# Altium project camera_module_dev.PrjPcb
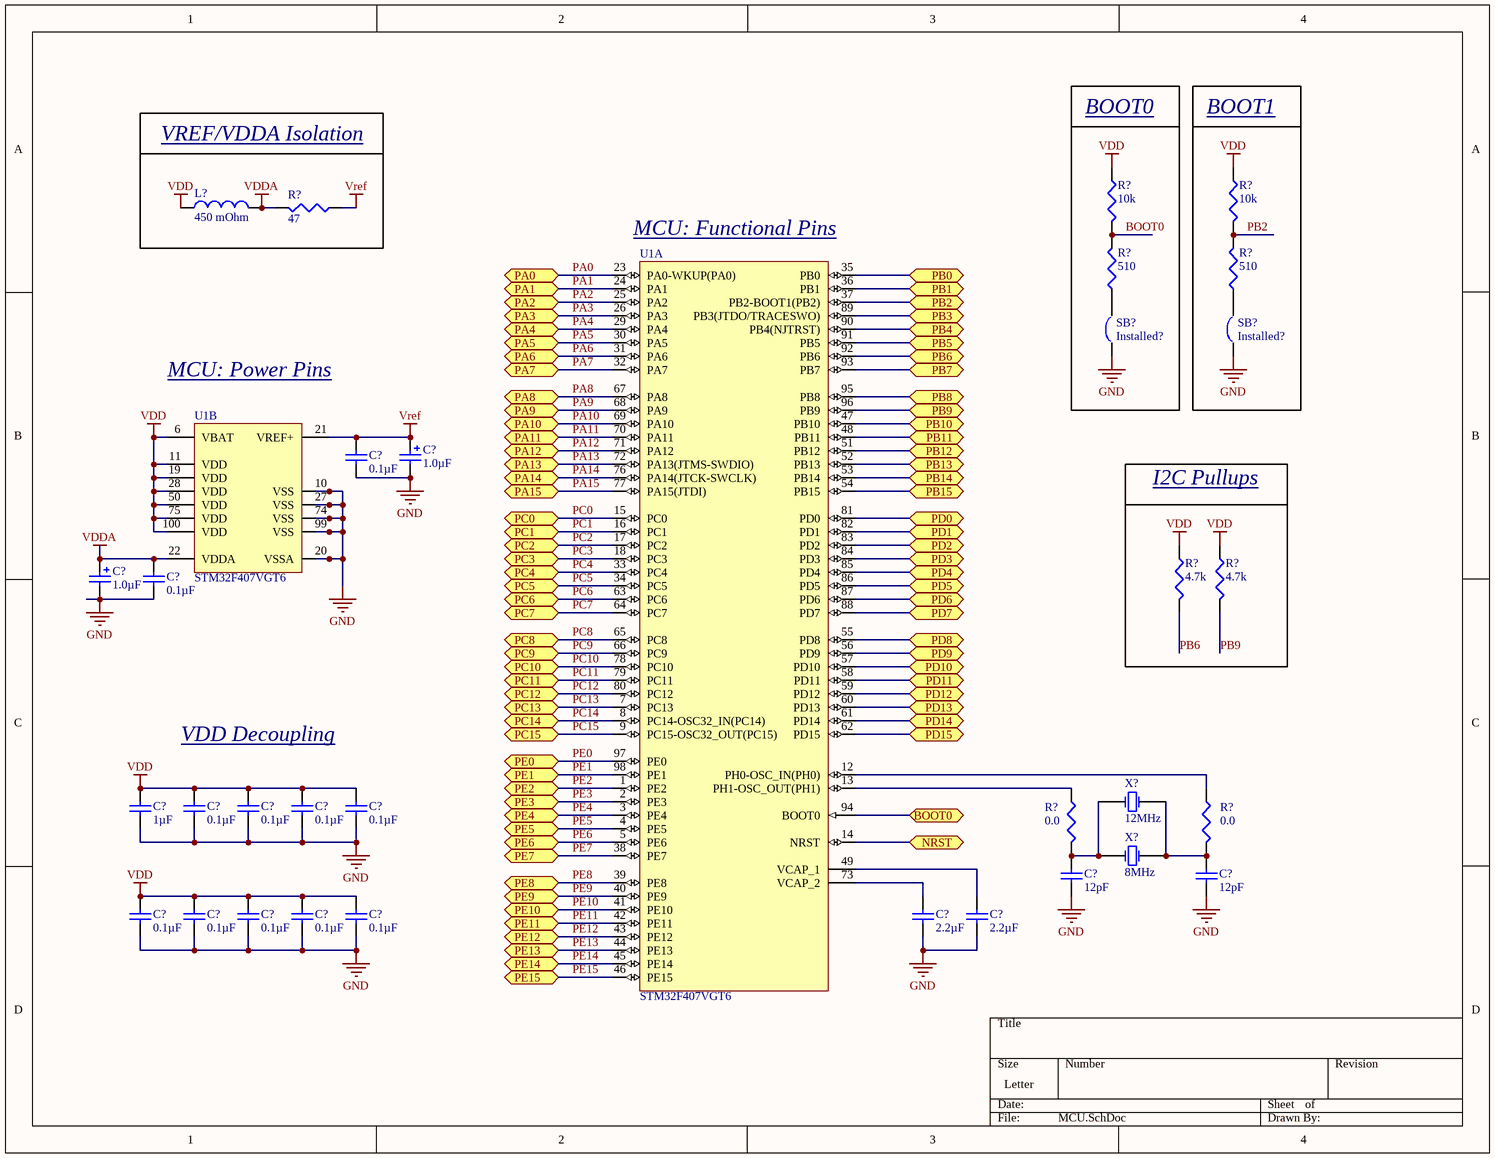
[diagram p0: MCU.SchDoc]
2 sheets, 33 parts. Net scope: flat (ports and power ports of the same name join across sheets).
Board file: camera_module_dev.PcbDoc
Sheets:
  top_level.SchDoc
  MCU.SchDoc

## Sheet top_level.SchDoc
size A

## Sheet MCU.SchDoc
size Letter

### Parts
(Parts that share a designator on the sheet are numbered #1, #2 ... from top to bottom, then left to right.)
C?#1  1.0µF  [CAPMP3216X11N]
C?#2  0.1µF  [CAPC1005X06N]
C?#3  1.0µF  [CAPMP3216X11N]
C?#4  0.1µF  [CAPC1005X06N]
C?#5  1µF  [CAPC1608X09N]
C?#6  0.1µF  [CAPC1005X06N]
C?#7  0.1µF  [CAPC1005X06N]
C?#8  0.1µF  [CAPC1005X06N]
C?#9  0.1µF  [CAPC1005X06N]
C?#10  Capacitance: 12pF  [CAPC1608X09N]  (hidden comment: CC0603JRNPO9BN120)
C?#11  Capacitance: 12pF  [CAPC1608X09N]  (hidden comment: CC0603JRNPO9BN120)
C?#12  0.1µF  [CAPC1005X06N]
C?#13  0.1µF  [CAPC1005X06N]
C?#14  0.1µF  [CAPC1005X06N]
C?#15  0.1µF  [CAPC1005X06N]
C?#16  0.1µF  [CAPC1005X06N]
C?#17  Capacitance: 2.2µF  [CAP-1206]  (hidden comment: CC1206KKX7R7BB225)
C?#18  Capacitance: 2.2µF  [CAP-1206]  (hidden comment: CC1206KKX7R7BB225)
L?  DC Resistance (DCR) (Max): 450 mOhm  [INDC1608X01N]  (hidden comment: FBMH1608HL601-T)
R?#1  Resistance (Ohms): 10k  [R0402]  (hidden comment: RC0402FR-0710KL)
R?#2  Resistance (Ohms): 10k  [R0402]  (hidden comment: RC0402FR-0710KL)
R?#3  Resistance (Ohms): 47  [R0603]  (hidden comment: RC0603FR-0747RL)
R?#4  Resistance (Ohms): 510  [R0603]  (hidden comment: RC0603FR-07510RL)
R?#5  Resistance (Ohms): 510  [R0603]  (hidden comment: RC0603FR-07510RL)
R?#6  Resistance (Ohms): 4.7k  [R0402]  (hidden comment: RC0402FR-074K7L)
R?#7  Resistance (Ohms): 4.7k  [R0402]  (hidden comment: RC0402FR-074K7L)
R?#8  Resistance (Ohms): 0.0  [R0603]  (hidden comment: RC0603JR-070RL)
R?#9  Resistance (Ohms): 0.0  [R0603]  (hidden comment: RC0603JR-070RL)
SB?#1  Installed?
SB?#2  Installed?
U1  STM32F407VGT6  [STM-LQFP100_N]  (parts A,B of 2)
X?#1  12MHz  [CRYSTAL-2.5X2.0]
X?#2  8MHz  [2-SMD_xtal]

### Blocks framed on the sheet
BOOT0: R?#1 R?#4 SB?#1
BOOT1: R?#2 R?#5 SB?#2
I2C Pullups: R?#6 R?#7

### Ports
BOOT0 (bidir), NRST (bidir), PA0 (bidir), PA1 (bidir), PA2 (bidir), PA3 (bidir), PA4 (bidir), PA5 (bidir), PA6 (bidir), PA7 (bidir), PA8 (bidir), PA9 (bidir), PA10 (bidir), PA11 (bidir), PA12 (bidir), PA13 (bidir), PA14 (bidir), PA15 (bidir), PB0 (bidir), PB1 (bidir), PB2 (bidir), PB3 (bidir), PB4 (bidir), PB5 (bidir), PB6 (bidir), PB7 (bidir), PB8 (bidir), PB9 (bidir), PB10 (bidir), PB11 (bidir), PB12 (bidir), PB13 (bidir), PB14 (bidir), PB15 (bidir), PC0 (bidir), PC1 (bidir), PC2 (bidir), PC3 (bidir), PC4 (bidir), PC5 (bidir), PC6 (bidir), PC7 (bidir), PC8 (bidir), PC9 (bidir), PC10 (bidir), PC11 (bidir), PC12 (bidir), PC13 (bidir), PC14 (bidir), PC15 (bidir), PD0 (bidir), PD1 (bidir), PD2 (bidir), PD3 (bidir), PD4 (bidir), PD5 (bidir), PD6 (bidir), PD7 (bidir), PD8 (bidir), PD9 (bidir), PD10 (bidir), PD11 (bidir), PD12 (bidir), PD13 (bidir), PD14 (bidir), PD15 (bidir), PE0 (bidir), PE1 (bidir), PE2 (bidir), PE3 (bidir), PE4 (bidir), PE5 (bidir), PE6 (bidir), PE7 (bidir), PE8 (bidir), PE9 (bidir), PE10 (bidir), PE11 (bidir), PE12 (bidir), PE13 (bidir), PE14 (bidir), PE15 (bidir)

### Nets
GND: C?#1.2 C?#2.1 C?#3.2 C?#4.1 C?#5.1 C?#6.1 C?#7.1 C?#8.1 C?#9.1 C?#10.1 C?#11.1 C?#12.1 C?#13.1 C?#14.1 C?#15.1 C?#16.1 C?#17.1 C?#18.1 SB?#1.1 SB?#2.1 U1.10(VSS) U1.20(VSSA) U1.27(VSS) U1.74(VSS) U1.99(VSS)
VDD: C?#5.2 C?#6.2 C?#7.2 C?#8.2 C?#9.2 C?#12.2 C?#13.2 C?#14.2 C?#15.2 C?#16.2 L?.1 R?#1.1 R?#2.1 R?#6.1 R?#7.1 U1.6(VBAT) U1.11(VDD) U1.19(VDD) U1.28(VDD) U1.50(VDD) U1.75(VDD) U1.100(VDD)
VDDA: C?#3.1 C?#4.2 L?.2 R?#3.2 U1.22(VDDA)
Vref: C?#1.1 C?#2.2 R?#3.1 U1.21(VREF+)
BOOT0: R?#1.2 R?#4.2
PA0: U1.23(PA0-WKUP(PA0)) ; port PA0
PA1: U1.24(PA1) ; port PA1
PA2: U1.25(PA2) ; port PA2
PA3: U1.26(PA3) ; port PA3
PA4: U1.29(PA4) ; port PA4
PA5: U1.30(PA5) ; port PA5
PA6: U1.31(PA6) ; port PA6
PA7: U1.32(PA7) ; port PA7
PA8: U1.67(PA8) ; port PA8
PA9: U1.68(PA9) ; port PA9
PA10: U1.69(PA10) ; port PA10
PA11: U1.70(PA11) ; port PA11
PA12: U1.71(PA12) ; port PA12
PA13: U1.72(PA13(JTMS-SWDIO)) ; port PA13
PA14: U1.76(PA14(JTCK-SWCLK)) ; port PA14
PA15: U1.77(PA15(JTDI)) ; port PA15
PB2: R?#2.2 R?#5.2
PB6: R?#6.2
PB9: R?#7.2
PC0: U1.15(PC0) ; port PC0
PC1: U1.16(PC1) ; port PC1
PC2: U1.17(PC2) ; port PC2
PC3: U1.18(PC3) ; port PC3
PC4: U1.33(PC4) ; port PC4
PC5: U1.34(PC5) ; port PC5
PC6: U1.63(PC6) ; port PC6
PC7: U1.64(PC7) ; port PC7
PC8: U1.65(PC8) ; port PC8
PC9: U1.66(PC9) ; port PC9
PC10: U1.78(PC10) ; port PC10
PC11: U1.79(PC11) ; port PC11
PC12: U1.80(PC12) ; port PC12
PC13: U1.7(PC13) ; port PC13
PC14: U1.8(PC14-OSC32_IN(PC14)) ; port PC14
PC15: U1.9(PC15-OSC32_OUT(PC15)) ; port PC15
PE0: U1.97(PE0) ; port PE0
PE1: U1.98(PE1) ; port PE1
PE2: U1.1(PE2) ; port PE2
PE3: U1.2(PE3) ; port PE3
PE4: U1.3(PE4) ; port PE4
PE5: U1.4(PE5) ; port PE5
PE6: U1.5(PE6) ; port PE6
PE7: U1.38(PE7) ; port PE7
PE8: U1.39(PE8) ; port PE8
PE9: U1.40(PE9) ; port PE9
PE10: U1.41(PE10) ; port PE10
PE11: U1.42(PE11) ; port PE11
PE12: U1.43(PE12) ; port PE12
PE13: U1.44(PE13) ; port PE13
PE14: U1.45(PE14) ; port PE14
PE15: U1.46(PE15) ; port PE15
NetC?#10_2: C?#10.2 R?#8.2 X?#1.1(OSC1) X?#2.1(OSC1)
NetC?#11_2: C?#11.2 R?#9.2 X?#1.3(OSC3) X?#2.2(OSC2)
NetC?#17_2: C?#17.2 U1.73(VCAP_2)
NetC?#18_2: C?#18.2 U1.49(VCAP_1)
NetR?#4_1: R?#4.1 SB?#1.2
NetR?#5_1: R?#5.1 SB?#2.2
NetR?#8_1: R?#8.1 U1.13(PH1-OSC_OUT(PH1))
NetR?#9_1: R?#9.1 U1.12(PH0-OSC_IN(PH0))
NetU1_14: U1.14(NRST) ; port NRST
NetU1_35: U1.35(PB0) ; port PB0
NetU1_36: U1.36(PB1) ; port PB1
NetU1_37: U1.37(PB2-BOOT1(PB2)) ; port PB2
NetU1_47: U1.47(PB10) ; port PB10
NetU1_48: U1.48(PB11) ; port PB11
NetU1_51: U1.51(PB12) ; port PB12
NetU1_52: U1.52(PB13) ; port PB13
NetU1_53: U1.53(PB14) ; port PB14
NetU1_54: U1.54(PB15) ; port PB15
NetU1_55: U1.55(PD8) ; port PD8
NetU1_56: U1.56(PD9) ; port PD9
NetU1_57: U1.57(PD10) ; port PD10
NetU1_58: U1.58(PD11) ; port PD11
NetU1_59: U1.59(PD12) ; port PD12
NetU1_60: U1.60(PD13) ; port PD13
NetU1_61: U1.61(PD14) ; port PD14
NetU1_62: U1.62(PD15) ; port PD15
NetU1_81: U1.81(PD0) ; port PD0
NetU1_82: U1.82(PD1) ; port PD1
NetU1_83: U1.83(PD2) ; port PD2
NetU1_84: U1.84(PD3) ; port PD3
NetU1_85: U1.85(PD4) ; port PD4
NetU1_86: U1.86(PD5) ; port PD5
NetU1_87: U1.87(PD6) ; port PD6
NetU1_88: U1.88(PD7) ; port PD7
NetU1_89: U1.89(PB3(JTDO/TRACESWO)) ; port PB3
NetU1_90: U1.90(PB4(NJTRST)) ; port PB4
NetU1_91: U1.91(PB5) ; port PB5
NetU1_92: U1.92(PB6) ; port PB6
NetU1_93: U1.93(PB7) ; port PB7
NetU1_94: U1.94(BOOT0) ; port BOOT0
NetU1_95: U1.95(PB8) ; port PB8
NetU1_96: U1.96(PB9) ; port PB9

Not connected (* = marked no-connect by the designer): X?#1 2(OSC2) 4(OSC4)

### Notes on the sheet
- VREF/VDDA Isolation
- (near U1) MCU: Functional Pins
- MCU: Power Pins
- VDD Decoupling

### Library data of the parts
C?#1 C?#3 = TAJA105K016RNJ: CAP TANT 1UF 16V 10% 1206; Manufacturer: AVX Corporation; Manufacturer Size Code: A; ESR (Equivalent Series Resistance): 11 Ohm; Type: Molded; Supplier 1: Digi-Key; Manufacturer Part Number: TAJA105K016RNJ; RoHS: RoHS Compliant; Category: Capacitors; Stock 1: 27486; Pricing 1: 1=0.62, 10=0.598, 100=0.2899, 250=0.24084, 500=0.21854, 1000=0.2007 (USD); Packaging: Cut Tape (CT); Capacitance: 1.0µF; Tolerance: ±10%; Voltage - Rated: 16V; Operating Temperature: -55°C ~ 125°C; Mounting Type: Surface Mount; Package / Case: 1206 (3216 Metric); Size / Dimension: 0.126" L x 0.063" W (3.20mm x 1.60mm); Height - Seated (Max): 0.071" (1.80mm); Lead Spacing: -; Features: General Purpose; Lifetime @ Temp.: -; ComponentLink1URL: http://datasheets.avx.com/TAJ.pdf; ComponentLink1Description: http://datasheets.avx.com/TAJ.pdf
C?#2 C?#4 C?#6-C?#9 C?#12-C?#16 = CC0402KRX7R7BB104: CAP CER 0.1UF 16V X7R 0402; Manufacturer: Yageo; Tolerance: ±10%; Supplier 1: Digi-Key; Manufacturer Part Number: CC0402KRX7R7BB104; RoHS: RoHS Compliant; Category: Capacitors; Stock 1: 2662097; Pricing 1: 1=0.1, 10=0.012, 25=0.0088, 100=0.0057, 250=0.00464, 500=0.00396, 1000=0.00309, 2500=0.00278, 5000=0.00257 (USD); Packaging: Cut Tape (CT); Capacitance: 0.1µF; Voltage - Rated: 16V; Temperature Coefficient: X7R; Mounting Type: Surface Mount, MLCC; Operating Temperature: -55°C ~ 125°C; Applications: General Purpose; Ratings: -; Package / Case: 0402 (1005 Metric); Size / Dimension: 0.039" L x 0.020" W (1.00mm x 0.50mm); Height - Seated (Max): -; Thickness (Max): 0.022" (0.55mm); Lead Spacing: -; Features: -; Lead Style: -; ComponentLink1URL: http://www.yageo.com/documents/recent/UPY-GPHC_X7R_6.3V-to-50V_13.pdf; ComponentLink1Description: http://www.yageo.com/documents/recent/UPY-GPHC_X7R_6.3V-to-50V_13.pdf; Supplier Part Number 1: 311-1338-1-ND
C?#5 = CC0603KRX5R7BB105: CAP CER 1UF 16V X5R 0603; Manufacturer: Yageo; Tolerance: ±10%; Supplier 1: Digi-Key; Manufacturer Part Number: CC0603KRX5R7BB105; RoHS: RoHS Compliant; Category: Capacitors; Stock 1: 204050; Pricing 1: 1=0.1, 10=0.04, 25=0.028, 100=0.0181, 250=0.01484, 500=0.0127, 1000=0.00989 (USD); Packaging: Cut Tape (CT); Capacitance: 1µF; Voltage - Rated: 16V; Temperature Coefficient: X5R; Mounting Type: Surface Mount, MLCC; Operating Temperature: -55°C ~ 85°C; Applications: General Purpose; Ratings: -; Package / Case: 0603 (1608 Metric); Size / Dimension: 0.063" L x 0.031" W (1.60mm x 0.80mm); Height - Seated (Max): -; Thickness (Max): 0.035" (0.90mm); Lead Spacing: -; Features: -; Lead Style: -; ComponentLink1URL: http://www.yageo.com/documents/recent/UPY-GPHC_X5R_4V-to-50V-21.pdf; ComponentLink1Description: http://www.yageo.com/documents/recent/UPY-GPHC_X5R_4V-to-50V-21.pdf; Supplier Part Number 1: 311-1444-1-ND
C?#10 C?#11 = CC0603JRNPO9BN120: CAP CER 12PF 50V NPO 0603; Manufacturer: Yageo; Tolerance: ±5%; Temperature Coefficient: C0G, NP0; Supplier 1: Digi-Key; Manufacturer Part Number: CC0603JRNPO9BN120; RoHS: RoHS Compliant; Category: Capacitors; Stock 1: 77610; Pricing 1: 1=0.1, 10=0.031, 25=0.0216, 100=0.014, 250=0.01148, 500=0.00982, 1000=0.00765 (USD); Packaging: Cut Tape (CT); Voltage - Rated: 50V; Mounting Type: Surface Mount, MLCC; Operating Temperature: -55°C ~ 125°C; Applications: General Purpose; Ratings: -; Package / Case: 0603 (1608 Metric); Size / Dimension: 0.063" L x 0.031" W (1.60mm x 0.80mm); Height - Seated (Max): -; Thickness (Max): 0.035" (0.90mm); Lead Spacing: -; Features: -; Lead Style: -; ComponentLink1URL: http://www.yageo.com/documents/recent/UPY-GP_NP0_16V-to-50V_10.pdf; ComponentLink1Description: http://www.yageo.com/documents/recent/UPY-GP_NP0_16V-to-50V_10.pdf; Supplier Part Number 1: 311-1059-1-ND
C?#17 C?#18 = CC1206KKX7R7BB225: CAP CER 2.2UF 16V X7R 1206; Manufacturer: Yageo; Tolerance: ±10%; Supplier 1: Digi-Key; Manufacturer Part Number: CC1206KKX7R7BB225; RoHS: RoHS Compliant; Category: Capacitors; Stock 1: 1171; Pricing 1: 1=0.21, 10=0.147, 25=0.1104, 100=0.07, 250=0.05896, 500=0.04938, 1000=0.04054 (USD); Packaging: Cut Tape (CT); Voltage - Rated: 16V; Temperature Coefficient: X7R; Mounting Type: Surface Mount, MLCC; Operating Temperature: -55°C ~ 125°C; Applications: General Purpose; Ratings: -; Package / Case: 1206 (3216 Metric); Size / Dimension: 0.126" L x 0.063" W (3.20mm x 1.60mm); Height - Seated (Max): -; Thickness (Max): 0.049" (1.25mm); Lead Spacing: -; Features: -; Lead Style: -; ComponentLink1URL: http://www.yageo.com/documents/recent/UPY-GPHC_X7R_6.3V-to-50V_13.pdf; ComponentLink1Description: http://www.yageo.com/documents/recent/UPY-GPHC_X7R_6.3V-to-50V_13.pdf; Supplier Part Number 1: 311-1957-1-ND
L? = FBMH1608HL601-T: FERRITE BEAD 600 OHM 0603; Manufacturer: Taiyo Yuden; Filter Type: Power Line; Number of Lines: 1; Impedance @ Frequency: 600 Ohm @ 100MHz; Current Rating (Max): 500mA; Supplier 1: Digi-Key; Manufacturer Part Number: FBMH1608HL601-T; RoHS: RoHS Compliant; Category: Filters; Stock 1: 6186; Pricing 1: 1=0.13, 10=0.105, 50=0.069, 100=0.0596, 250=0.04704, 500=0.03972, 1000=0.03344 (USD); Packaging: Cut Tape (CT); Ratings: -; Operating Temperature: -40°C ~ 125°C; Package / Case: 0603 (1608 Metric); Mounting Type: Surface Mount; Height (Max): 0.035" (0.90mm); Size / Dimension: 0.063" L x 0.031" W (1.60mm x 0.80mm); ComponentLink1URL: http://ds.yuden.co.jp/TYCOMPAS/ut/detail.do?productNo=FBMH1608HL601-T&fileName=FBMH1608HL601-T_SS&mode=specSheetDownload; ComponentLink1Description: http://ds.yuden.co.jp/TYCOMPAS/ut/detail.do?productNo=FBMH1608HL601-T&fileName=FBMH1608HL601-T_SS&mode=specSheetDownload; Supplier Part Number 1: 587-1737-1-ND
R?#1 R?#2 = RC0402FR-0710KL: RES SMD 10K OHM 1% 1/16W 0402; Manufacturer: Yageo; Power (Watts): 0.063W, 1/16W; Temperature Coefficient: ±100ppm/°C; Supplier 1: Digi-Key; Manufacturer Part Number: RC0402FR-0710KL; RoHS: RoHS Compliant; Category: Resistors; Stock 1: 6043320; Pricing 1: 1=0.1, 10=0.013, 25=0.0096, 100=0.0054, 250=0.00412, 500=0.00328, 1000=0.00242, 2500=0.0021, 5000=0.00173 (USD); Packaging: Cut Tape (CT); Tolerance: ±1%; Composition: Thick Film; Features: Moisture Resistant; Operating Temperature: -55°C ~ 155°C; Package / Case: 0402 (1005 Metric); Supplier Device Package: 0402; Size / Dimension: 0.039" L x 0.020" W (1.00mm x 0.50mm); Height: 0.016" (0.40mm); Number of Terminations: 2; ComponentLink1URL: http://www.yageo.com/NewPortal/yageodocoutput?fileName=/pdf/R-Chip/PYu-RC_Group_51_RoHS_L_3.pdf; ComponentLink1Description: http://www.yageo.com/NewPortal/yageodocoutput?fileName=/pdf/R-Chip/PYu-RC_Group_51_RoHS_L_3.pdf; Supplier Part Number 1: 311-10.0KLRCT-ND
R?#3 = RC0603FR-0747RL: RES SMD 47 OHM 1% 1/10W 0603; Manufacturer: Yageo; Power (Watts): 0.1W, 1/10W; Temperature Coefficient: ±100ppm/°C; Supplier 1: Digi-Key; Manufacturer Part Number: RC0603FR-0747RL; RoHS: RoHS Compliant; Category: Resistors; Stock 1: 182068; Pricing 1: 1=0.1, 10=0.014, 25=0.01, 100=0.0057, 250=0.00436, 500=0.00348, 1000=0.00257, 2500=0.00223 (USD); Packaging: Cut Tape (CT); Tolerance: ±1%; Composition: Thick Film; Features: Moisture Resistant; Operating Temperature: -55°C ~ 155°C; Package / Case: 0603 (1608 Metric); Supplier Device Package: 0603; Size / Dimension: 0.063" L x 0.031" W (1.60mm x 0.80mm); Height: 0.022" (0.55mm); Number of Terminations: 2; ComponentLink1URL: http://www.yageo.com/NewPortal/yageodocoutput?fileName=/pdf/R-Chip/PYu-RC_Group_51_RoHS_L_3.pdf; ComponentLink1Description: http://www.yageo.com/NewPortal/yageodocoutput?fileName=/pdf/R-Chip/PYu-RC_Group_51_RoHS_L_3.pdf; Supplier Part Number 1: 311-47.0HRCT-ND
R?#4 R?#5 = RC0603FR-07510RL: RES SMD 510 OHM 1% 1/10W 0603; Manufacturer: Yageo; Power (Watts): 0.1W, 1/10W; Temperature Coefficient: ±100ppm/°C; Supplier 1: Digi-Key; Manufacturer Part Number: RC0603FR-07510RL; RoHS: RoHS Compliant; Category: Resistors; Stock 1: 64737; Pricing 1: 1=0.1, 10=0.014, 25=0.01, 100=0.0057, 250=0.00436, 500=0.00348, 1000=0.00257, 2500=0.00223 (USD); Packaging: Cut Tape (CT); Tolerance: ±1%; Composition: Thick Film; Features: Moisture Resistant; Operating Temperature: -55°C ~ 155°C; Package / Case: 0603 (1608 Metric); Supplier Device Package: 0603; Size / Dimension: 0.063" L x 0.031" W (1.60mm x 0.80mm); Height: 0.022" (0.55mm); Number of Terminations: 2; ComponentLink1URL: http://www.yageo.com/NewPortal/yageodocoutput?fileName=/pdf/R-Chip/PYu-RC_Group_51_RoHS_L_3.pdf; ComponentLink1Description: http://www.yageo.com/NewPortal/yageodocoutput?fileName=/pdf/R-Chip/PYu-RC_Group_51_RoHS_L_3.pdf; Supplier Part Number 1: 311-510HRCT-ND
R?#6 R?#7 = RC0402FR-074K7L: RES SMD 4.7K OHM 1% 1/16W 0402; Manufacturer: Yageo; Power (Watts): 0.063W, 1/16W; Temperature Coefficient: ±100ppm/°C; Supplier 1: Digi-Key; Manufacturer Part Number: RC0402FR-074K7L; RoHS: RoHS Compliant; Category: Resistors; Stock 1: 1017261; Pricing 1: 1=0.1, 10=0.013, 25=0.0096, 100=0.0054, 250=0.00412, 500=0.00328, 1000=0.00242, 2500=0.0021, 5000=0.00173 (USD); Packaging: Cut Tape (CT); Tolerance: ±1%; Composition: Thick Film; Features: Moisture Resistant; Operating Temperature: -55°C ~ 155°C; Package / Case: 0402 (1005 Metric); Supplier Device Package: 0402; Size / Dimension: 0.039" L x 0.020" W (1.00mm x 0.50mm); Height: 0.016" (0.40mm); Number of Terminations: 2; ComponentLink1URL: http://www.yageo.com/NewPortal/yageodocoutput?fileName=/pdf/R-Chip/PYu-RC_Group_51_RoHS_L_3.pdf; ComponentLink1Description: http://www.yageo.com/NewPortal/yageodocoutput?fileName=/pdf/R-Chip/PYu-RC_Group_51_RoHS_L_3.pdf; Supplier Part Number 1: 311-4.7KLRCT-ND
R?#8 R?#9 = RC0603JR-070RL: RES SMD 0.0OHM JUMPER 1/10W 0603; Manufacturer: Yageo; Power (Watts): 0.1W, 1/10W; Supplier 1: Digi-Key; Manufacturer Part Number: RC0603JR-070RL; RoHS: RoHS Compliant; Category: Resistors; Stock 1: 6656914; Pricing 1: 1=0.1, 10=0.011, 25=0.008, 100=0.0045, 250=0.00348, 500=0.00278, 1000=0.00204, 2500=0.00177 (USD); Packaging: Cut Tape (CT); Tolerance: Jumper; Composition: Thick Film; Features: Moisture Resistant; Temperature Coefficient: -; Operating Temperature: -55°C ~ 155°C; Package / Case: 0603 (1608 Metric); Supplier Device Package: 0603; Size / Dimension: 0.063" L x 0.031" W (1.60mm x 0.80mm); Height: 0.022" (0.55mm); Number of Terminations: 2; ComponentLink1URL: http://www.yageo.com/NewPortal/yageodocoutput?fileName=/pdf/R-Chip/PYu-RC_Group_51_RoHS_L_3.pdf; ComponentLink1Description: http://www.yageo.com/NewPortal/yageodocoutput?fileName=/pdf/R-Chip/PYu-RC_Group_51_RoHS_L_3.pdf; Supplier Part Number 1: 311-0.0GRCT-ND
SB?#1 SB?#2 = SB
U1 = STM32F407VGT6: ARM Cortex-M4 32-bit MCU+FPU, 210 DMIPS, 1024 kB Flash, 192 kB Internal RAM, 82 I/Os, 100-pin LQFP, -40 to 85 degC, Tray; Manufacturer: STMicroelectronics; D/A Converter: 2x12-bit; FLASH Size (Prog) (kB): 1024; I/Os (High Current): 82; Internal RAM Size (kB): 192; Operating Frequency(F) (Processor speed) (MHz): 168; Supply Voltage(Vcc) max (V): 3.6; Supply Voltage(Vcc) min (V): 1.8; DatasheetVersion: Rev. 4; PackageVersion: Rev. 1, 06/2013; PackageReference: LQFP100; PackageDescription: 100-Pin Low Profile Quad Flat Package, 14 x 14 mm Body, 0.5 mm Pitch; Supplier 1: Digi-Key; Supplier Part Number 1: 497-11605-ND; Supplier 2: Farnell; Supplier Part Number 2: 2064368; Supplier 3: Newark; Supplier Part Number 3: 73T2333; Supplier 4: Mouser; Supplier Part Number 4: 511-STM32F407VGT6; Core: ARM Cortex-M4; Packing: Tray; Mounting Technology: Surface Mount; PartNumber: STM32F407VGT6; ComponentLink1Description: Manufacturer URL; ComponentLink1URL: http://www.st.com/web/en/home.html; ComponentLink2Description: Datasheet; ComponentLink2URL: http://www.st.com/st-web-ui/static/active/en/resource/technical/document/datasheet/DM00037051.pdf; ComponentLink3Description: Package Specification; ComponentLink3URL: http://www.st.com/st-web-ui/static/active/en/resource/technical/document/data_brief/DM00071938.pdf
X?#1 = 7S-12.000MAHE-T: CRYSTAL 12.0000MHZ 12PF SMD; Manufacturer: TXC CORPORATION; Frequency Stability: ±30ppm; ESR (Equivalent Series Resistance): 200 Ohm; Operating Mode: Fundamental; Supplier 1: Digi-Key; Manufacturer Part Number: 7S-12.000MAHE-T; RoHS: RoHS Compliant; Category: Crystals and Oscillators; Stock 1: 18992; Pricing 1: 1=0.96, 10=0.847, 50=0.791, 100=0.7, 500=0.6615, 1000=0.553 (USD); Packaging: Cut Tape (CT); Type: MHz Crystal; Frequency: 12MHz; Frequency Tolerance: ±30ppm; Load Capacitance: 12pF; Operating Temperature: -40°C ~ 85°C; Ratings: -; Mounting Type: Surface Mount; Package / Case: 4-SMD, No Lead (DFN, LCC); Size / Dimension: 0.098" L x 0.079" W (2.50mm x 2.00mm); Height: 0.033" (0.85mm); ComponentLink1URL: http://www.txccrystal.com/images/pdf/7s.pdf; ComponentLink1Description: http://www.txccrystal.com/images/pdf/7s.pdf; Supplier Part Number 1: 887-1831-1-ND
X?#2 = CX5032GB08000H0HEQZ1: CRYSTAL 8.0000MHZ 12PF SMD; Manufacturer: AVX Corp/Kyocera Corp; Frequency Stability: ±30ppm; Frequency Tolerance: ±20ppm; ESR (Equivalent Series Resistance): 300 Ohm; Operating Mode: Fundamental; Supplier 1: Digi-Key; Manufacturer Part Number: CX5032GB08000H0HEQZ1; RoHS: RoHS Compliant; Category: Crystals and Oscillators; Stock 1: 986; Pricing 1: 1=0.96, 10=0.847, 50=0.791, 100=0.7, 500=0.6615 (USD); Packaging: Cut Tape (CT); Type: MHz Crystal; Frequency: 8MHz; Load Capacitance: 12pF; Operating Temperature: -10°C ~ 70°C; Ratings: -; Mounting Type: Surface Mount; Package / Case: 2-SMD; Size / Dimension: 0.197" L x 0.126" W (5.00mm x 3.20mm); Height: 0.047" (1.20mm); ComponentLink1URL: http://www.kyocera-crystal.jp/eng/wp-content/uploads/2014/09/cx5032gb_e.pdf; ComponentLink1Description: http://www.kyocera-crystal.jp/eng/wp-content/uploads/2014/09/cx5032gb_e.pdf; Supplier Part Number 1: 478-6970-1-ND